# EAGLE board Full (EAGLE 9.6.2)
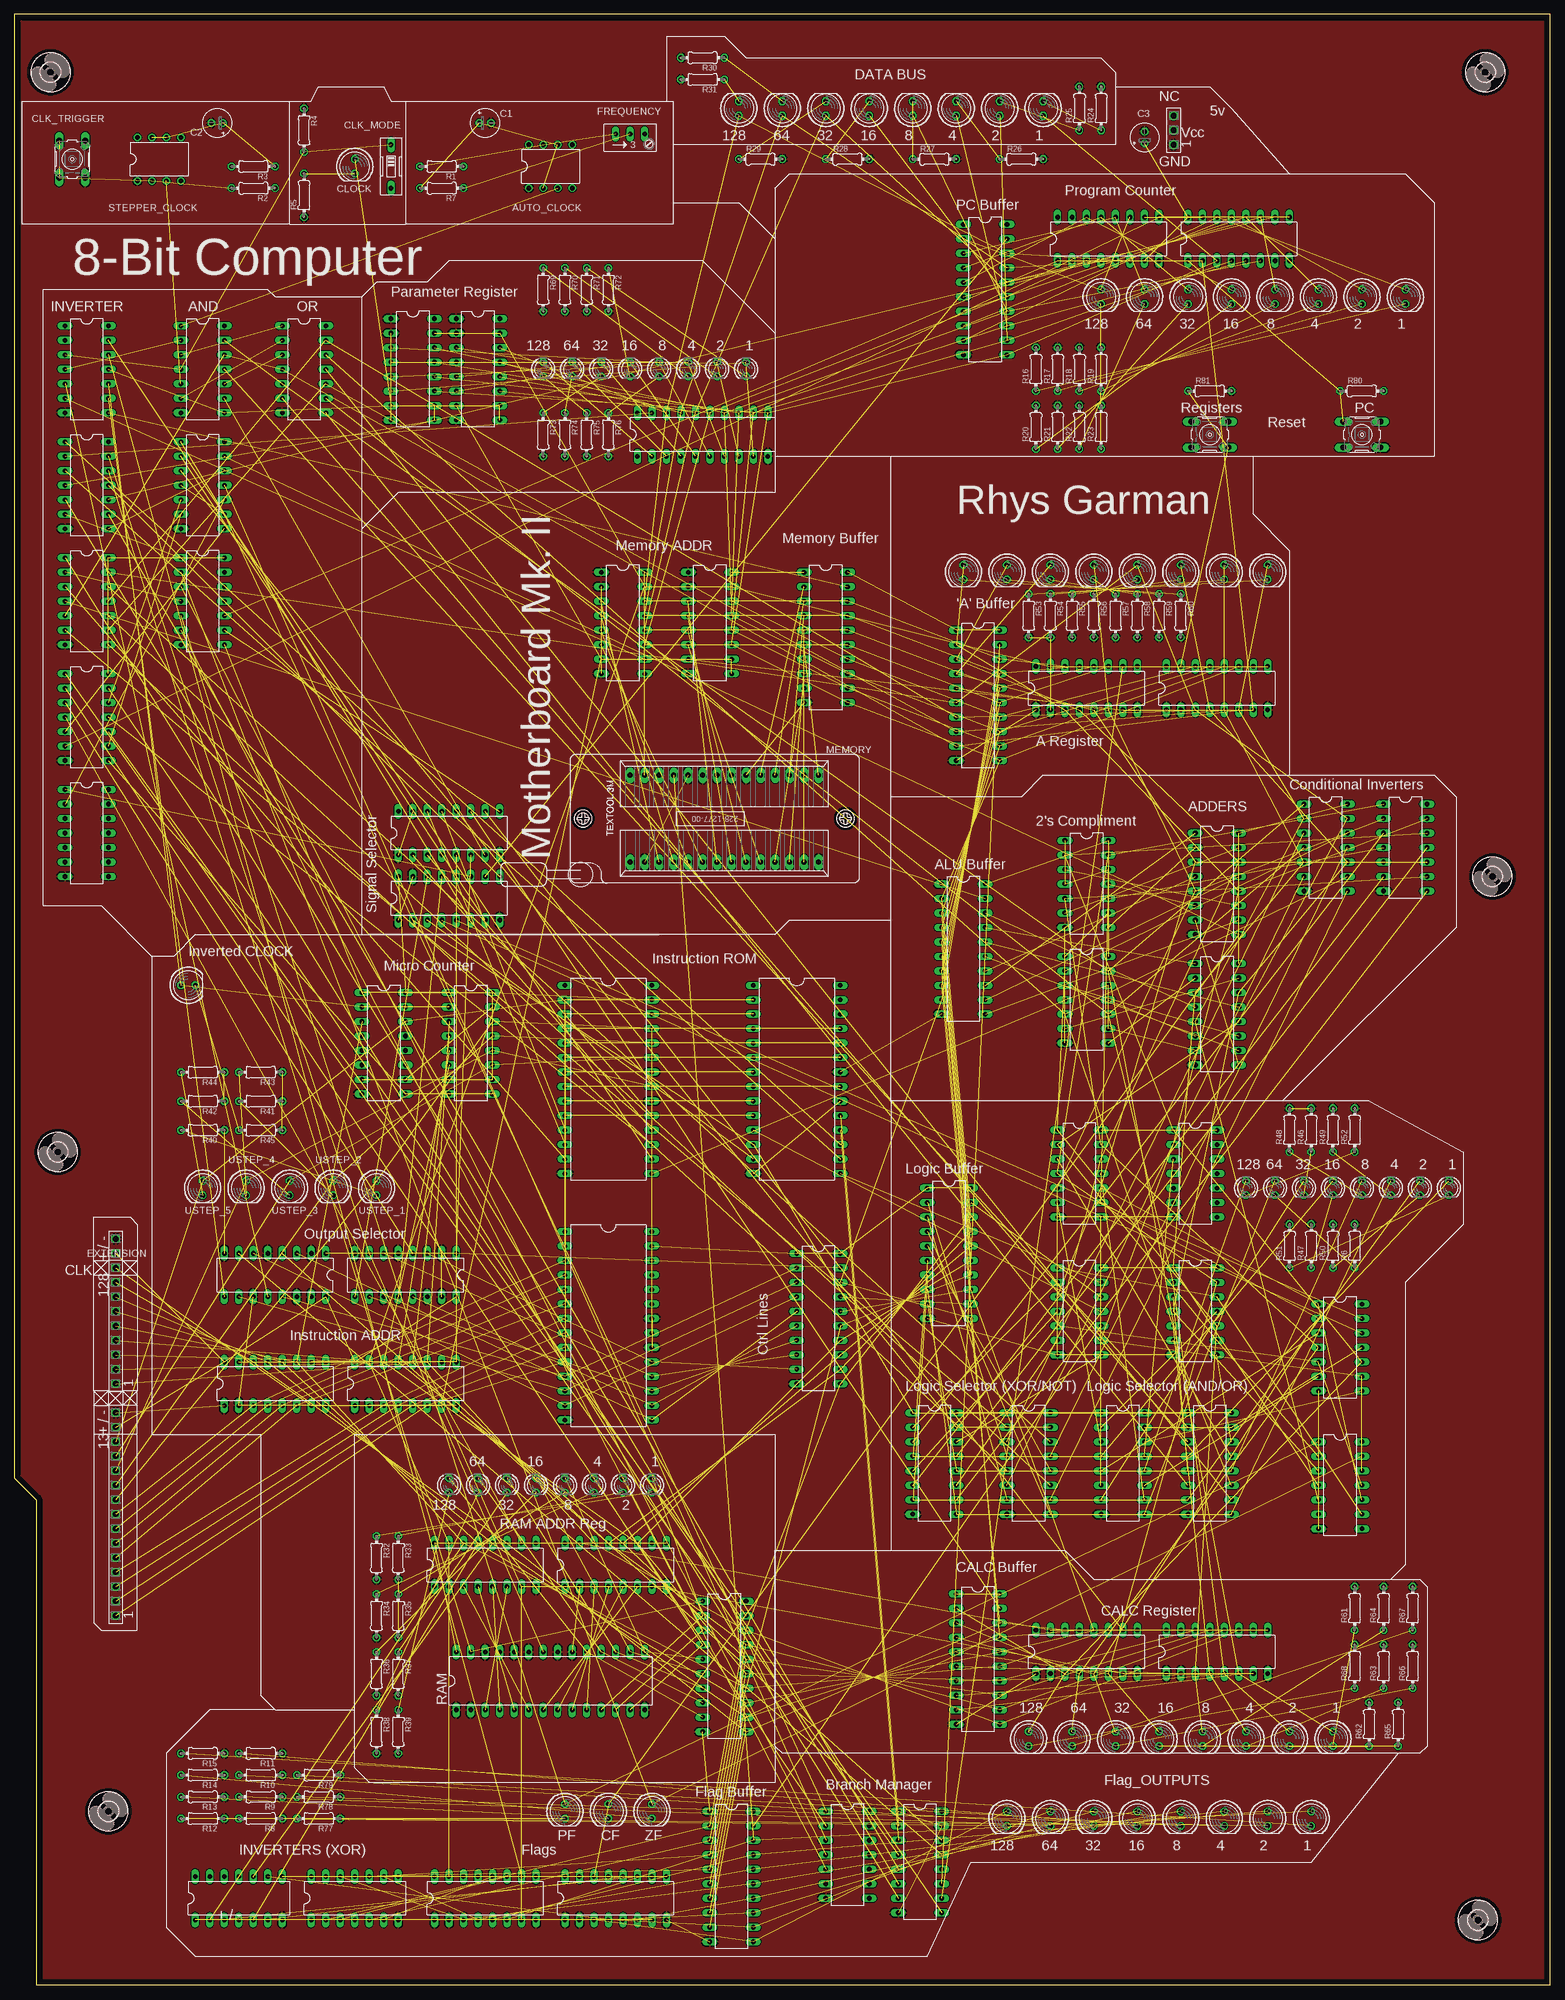
[diagram p5: board, top side]
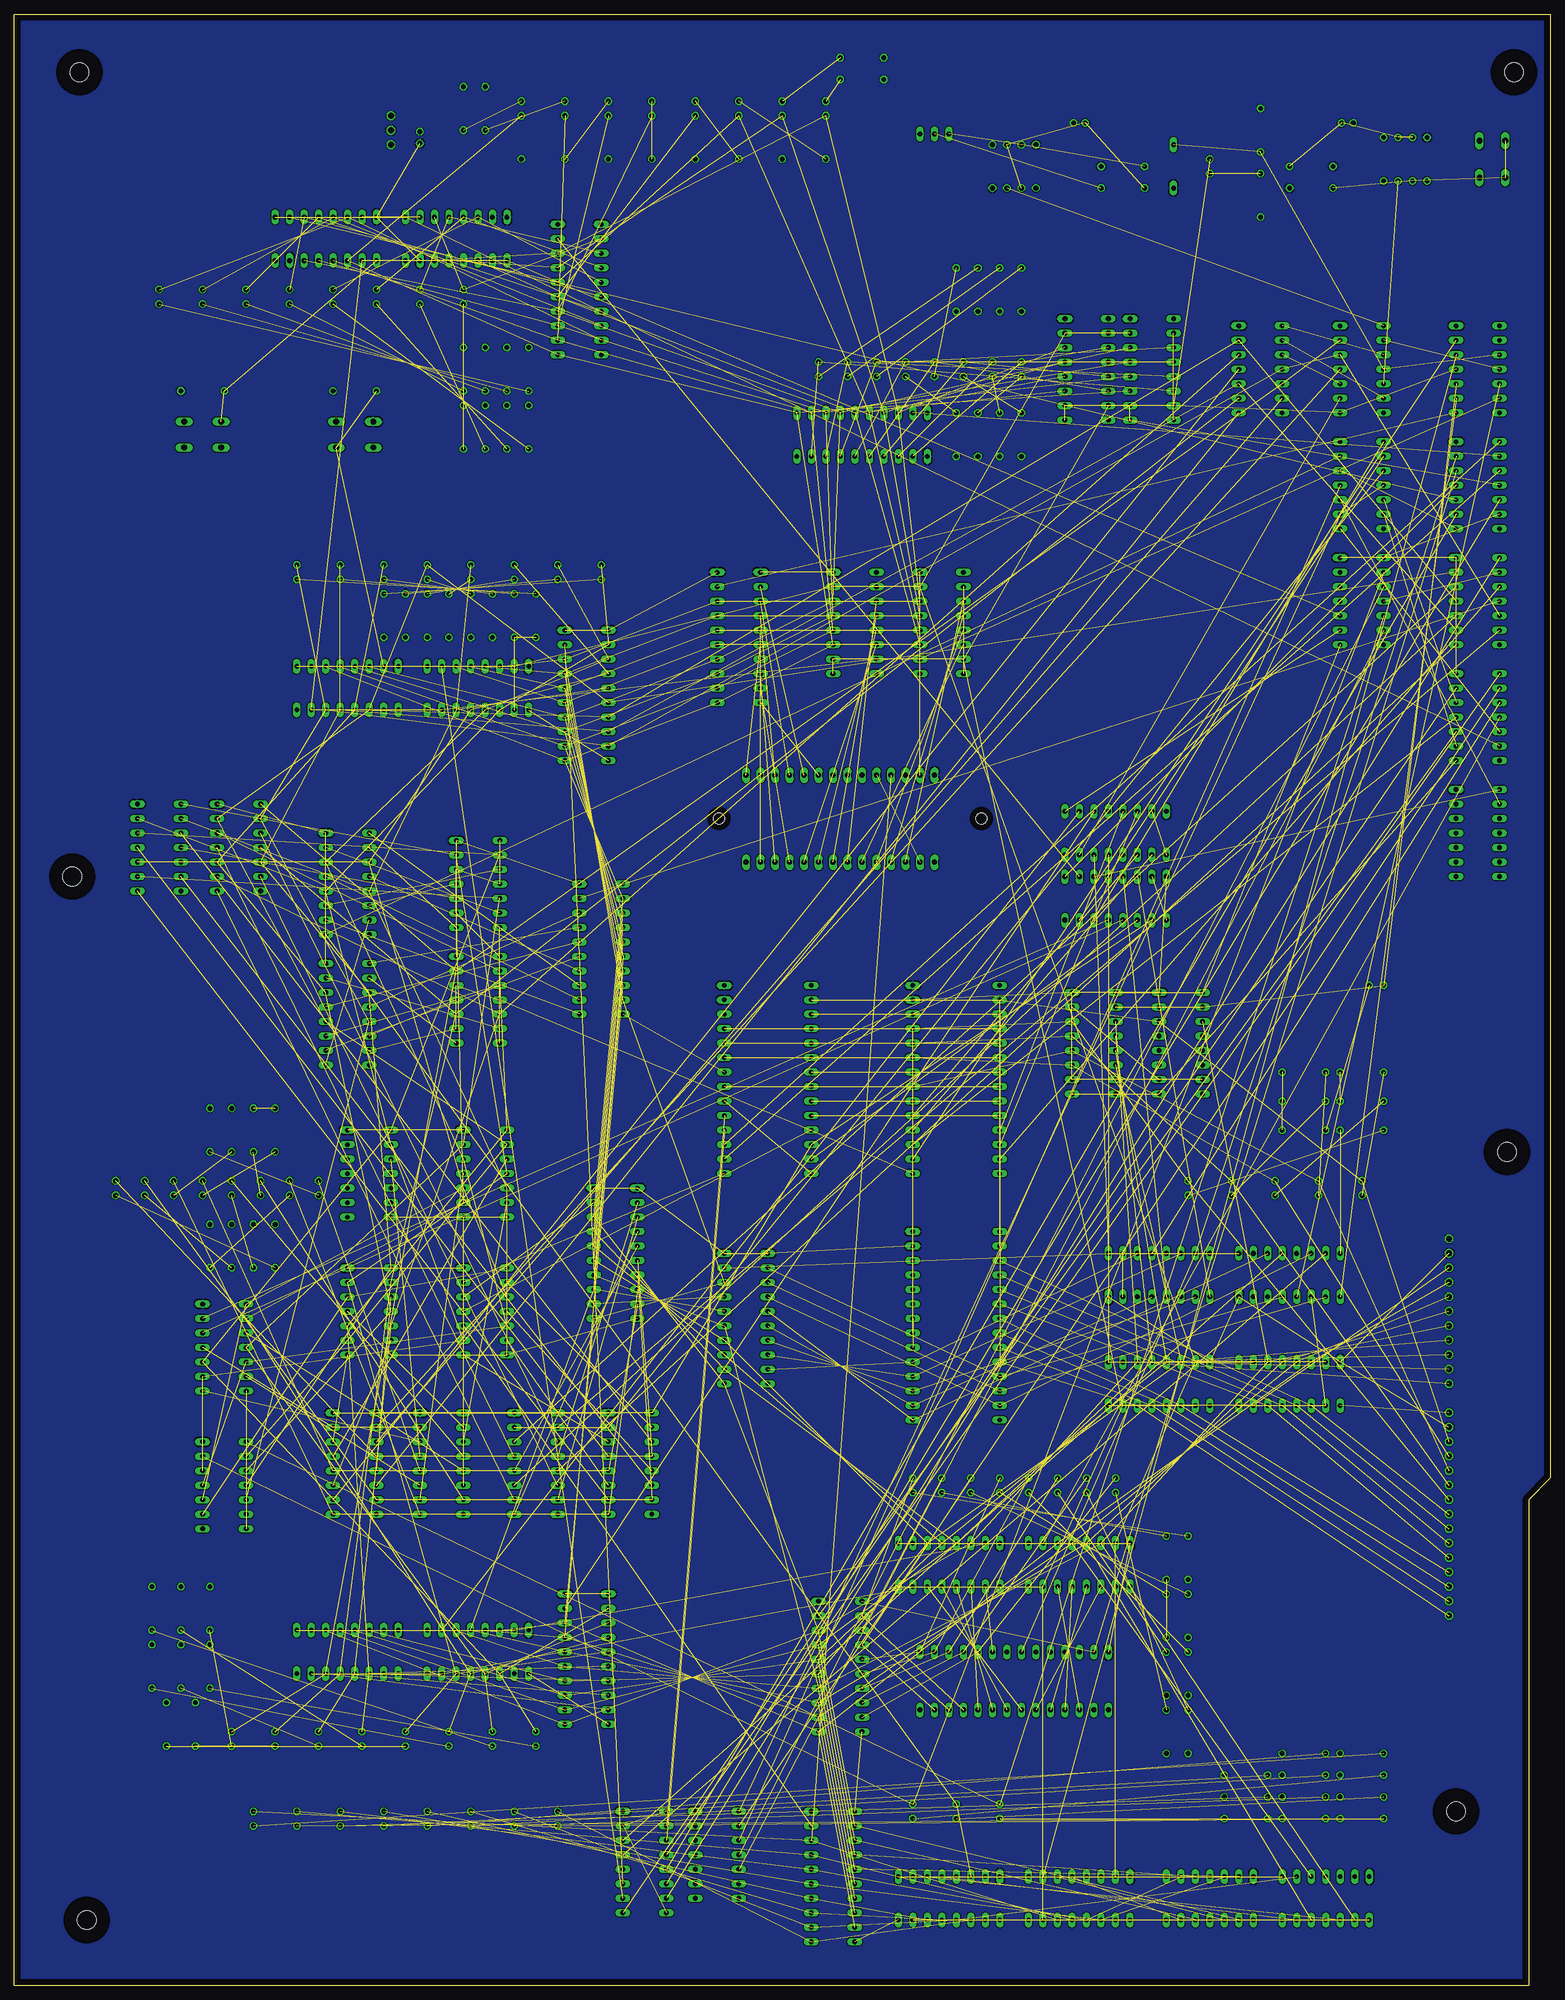
[diagram p6: board, bottom side, seen from below]

Size 269.24 x 345.44 mm. Coordinates in mm from the lower left corner, seen from the top.
Outline: 269.24,345.44 0,345.44 0,88.9 3.81,85.09 3.81,0 269.24,0 269.24,345.44
Copper layers (1*16): Top 0.035mm / dielectric 1.5mm / Bottom 0.035mm
Design rules "default": minimum track width 6mil, minimum drill 0.35mm, track to track 6mil, track to pad 6mil, pad to pad 6mil, via to via 6mil, smd to smd 6mil, copper to edge 40mil, drill to drill 6mil, minimum pad ring 10mil, minimum via ring 8mil, stop-mask expansion 4mil, vias tented up to drill 0mil, thermal gap 10mil

## Footprints (pad centres in the part's own frame; a part is rotated, then mirrored left to right if it is on the bottom)
DIL14 = drill 0.813 long: 1 -7.62,-3.81; 2 -5.08,-3.81; 3 -2.54,-3.81; 4 0,-3.81; 5 2.54,-3.81; 6 5.08,-3.81; 7 7.62,-3.81; 8 7.62,3.81; 9 5.08,3.81; 10 2.54,3.81; 11 0,3.81; 12 -2.54,3.81; 13 -5.08,3.81; 14 -7.62,3.81
DIL16 = drill 0.813 long: 1 -8.89,-3.81; 2 -6.35,-3.81; 3 -3.81,-3.81; 4 -1.27,-3.81; 5 1.27,-3.81; 6 3.81,-3.81; 7 6.35,-3.81; 8 8.89,-3.81; 9 8.89,3.81; 10 6.35,3.81; 11 3.81,3.81; 12 1.27,3.81; 13 -1.27,3.81; 14 -3.81,3.81; 15 -6.35,3.81; 16 -8.89,3.81
DIL08 = drill 0.813 pad 1.27: 1 -3.81,-3.81; 2 -1.27,-3.81; 3 1.27,-3.81; 4 3.81,-3.81; 5 3.81,3.81; 6 1.27,3.81; 7 -1.27,3.81; 8 -3.81,3.81
E2-5 = drill 0.813 pad 1.27: + -1.016,0 | drill 0.813 pad 1.27 octagon: - 1.016,0
EDG-01 = drill 0.813 long: 1 0,-3.81; 2 0,3.81
B3F-10XX = drill 1.016 long: 1 -3.251,2.261; 2 3.251,2.261; 3 -3.251,-2.261; 4 3.251,-2.261
LED5MM = drill 0.813 octagon: A -1.27,0; K 1.27,0
SSW-111-02-G-S = drill 1 pad 1.5 octagon: 1 -12.7,0; 2 -10.16,0; 3 -7.62,0; 4 -5.08,0; 5 -2.54,0; 6 0,0; 7 2.54,0; 8 5.08,0; 9 7.62,0; 10 10.16,0; 11 12.7,0
RJ9W = drill 0.813 long: A 2.54,0.635; E -2.54,0.635; S 0,0.635
DIL28-6 = drill 0.813 long: 1 -16.51,-7.62; 2 -13.97,-7.62; 3 -11.43,-7.62; 4 -8.89,-7.62; 5 -6.35,-7.62; 6 -3.81,-7.62; 7 -1.27,-7.62; 8 1.27,-7.62; 9 3.81,-7.62; 10 6.35,-7.62; 11 8.89,-7.62; 12 11.43,-7.62; 13 13.97,-7.62; 14 16.51,-7.62; 15 16.51,7.62; 16 13.97,7.62; 17 11.43,7.62; 18 8.89,7.62; 19 6.35,7.62; 20 3.81,7.62; 21 1.27,7.62; 22 -1.27,7.62; 23 -3.81,7.62; 24 -6.35,7.62; 25 -8.89,7.62; 26 -11.43,7.62; 27 -13.97,7.62; 28 -16.51,7.62
SSW-115-02-G-S = drill 1 pad 1.5 octagon: 1 -17.78,0; 2 -15.24,0; 3 -12.7,0; 4 -10.16,0; 5 -7.62,0; 6 -5.08,0; 7 -2.54,0; 8 0,0; 9 2.54,0; 10 5.08,0; 11 7.62,0; 12 10.16,0; 13 12.7,0; 14 15.24,0; 15 17.78,0
LED3MM = drill 0.813 octagon: A -1.27,0; K 1.27,0
228-1277-00-0602J = drill 0.9 long: 1 -16.51,-7.62; 2 -13.97,-7.62; 3 -11.43,-7.62; 4 -8.89,-7.62; 5 -6.35,-7.62; 6 -3.81,-7.62; 7 -1.27,-7.62; 8 1.27,-7.62; 9 3.81,-7.62; 10 6.35,-7.62; 11 8.89,-7.62; 12 11.43,-7.62; 13 13.97,-7.62; 14 16.51,-7.62; 15 16.51,7.62; 16 13.97,7.62; 17 11.43,7.62; 18 8.89,7.62; 19 6.35,7.62; 20 3.81,7.62; 21 1.27,7.62; 22 -1.27,7.62; 23 -3.81,7.62; 24 -6.35,7.62; 25 -8.89,7.62; 26 -11.43,7.62; 27 -13.97,7.62; 28 -16.51,7.62 | hole 2: 21.24,0; -24.74,0
DIL20 = drill 0.813 long: 1 -11.43,-3.81; 2 -8.89,-3.81; 3 -6.35,-3.81; 4 -3.81,-3.81; 5 -1.27,-3.81; 6 1.27,-3.81; 7 3.81,-3.81; 8 6.35,-3.81; 9 8.89,-3.81; 10 11.43,-3.81; 11 11.43,3.81; 12 8.89,3.81; 13 6.35,3.81; 14 3.81,3.81; 15 1.27,3.81; 16 -1.27,3.81; 17 -3.81,3.81; 18 -6.35,3.81; 19 -8.89,3.81; 20 -11.43,3.81
0204/7 = drill 0.813 octagon: 1 -3.81,0; 2 3.81,0
DIL28-4 = drill 0.813 long: 1 -16.51,-5.08; 2 -13.97,-5.08; 3 -11.43,-5.08; 4 -8.89,-5.08; 5 -6.35,-5.08; 6 -3.81,-5.08; 7 -1.27,-5.08; 8 1.27,-5.08; 9 3.81,-5.08; 10 6.35,-5.08; 11 8.89,-5.08; 12 11.43,-5.08; 13 13.97,-5.08; 14 16.51,-5.08; 15 16.51,5.08; 16 13.97,5.08; 17 11.43,5.08; 18 8.89,5.08; 19 6.35,5.08; 20 3.81,5.08; 21 1.27,5.08; 22 -1.27,5.08; 23 -3.81,5.08; 24 -6.35,5.08; 25 -8.89,5.08; 26 -11.43,5.08; 27 -13.97,5.08; 28 -16.51,5.08
3,3 = hole 3.3: 0,0
SSW-103-02-G-S = drill 1 pad 1.5 octagon: 1 -2.54,0; 2 0,0; 3 2.54,0

## Placement (x,y rotation side)
4_INP_OR_GATE  4072N  [DIL14]  146.05,22.86 270 top
ADDER_LOWER  74LS283N  [DIL16]  210.82,170.18 270 top
ADDER_UPPER  74LS283N  [DIL16]  210.82,193.04 270 top
ADDR_MEM_REG_LOWER  74LS173N  [DIL16]  121.92,238.76 270 top
ADDR_MEM_REG_UPPER  74LS173N  [DIL16]  106.68,238.76 270 top
ADDR_REG_A_LOWER  74LS173N  [DIL16]  210.82,227.33 0 top
ADDR_REG_A_UPPER  74LS173N  [DIL16]  187.96,227.33 0 top
ADDR_REG_CALC_LOWER  74LS173N  [DIL16]  210.82,58.42 0 top
ADDR_REG_CALC_UPPER  74LS173N  [DIL16]  187.96,58.42 0 top
ADDR_REG_PARAM_LOWER  74LS173N  [DIL16]  69.85,283.21 270 top
ADDR_REG_PARAM_UPPER  74LS173N  [DIL16]  81.28,283.21 270 top
AND_GATE1_  74LS08N  [DIL14]  207.01,118.11 270 top
AND_GATE2_  74LS08N  [DIL14]  232.41,111.76 270 top
AND_GATE3_  74LS08N  [DIL14]  33.02,262.89 270 top
AND_GATE4_  74LS08N  [DIL14]  33.02,242.57 270 top
AND_GATE_  74LS08N  [DIL14]  33.02,283.21 270 top
AUTO_CLOCK  NE555N  [DIL08]  93.98,318.77 0 top
BRANCH_SELECTOR  74HC139N  [DIL16]  158.75,21.59 270 top
C1  4.7uF  [E2-5]  82.55,326.39 0 top
C2  0.1uF  [E2-5]  35.56,326.39 180 top
C3  0.1uF  [E2-5]  198.12,323.85 90 top
CLK_MODE  [EDG-01]  66.04,318.77 180 top
CLK_TRIGGER  [B3F-10XX]  10.16,320.04 90 top
CLOCK  [LED5MM]  59.69,318.77 270 top
DATABUS_1  LED  [LED5MM]  180.34,328.93 90 top
DATABUS_2  [LED5MM]  172.72,328.93 90 top
DATABUS_3  [LED5MM]  165.1,328.93 90 top
DATABUS_4  [LED5MM]  157.48,328.93 90 top
DATABUS_5  [LED5MM]  149.86,328.93 90 top
DATABUS_6  [LED5MM]  142.24,328.93 90 top
DATABUS_7  [LED5MM]  134.62,328.93 90 top
DATABUS_8  [LED5MM]  127,328.93 90 top
EXTENSION  SSW-111-02-G-S  [SSW-111-02-G-S]  17.78,118.11 90 top
FLAG_1  [LED5MM]  227.33,29.21 270 top
FLAG_2  [LED5MM]  219.71,29.21 270 top
FLAG_3  [LED5MM]  212.09,29.21 270 top
FLAG_4  [LED5MM]  204.47,29.21 270 top
FLAG_5  [LED5MM]  196.85,29.21 270 top
FLAG_6  [LED5MM]  189.23,29.21 270 top
FLAG_7  [LED5MM]  181.61,29.21 270 top
FLAG_8  [LED5MM]  173.99,29.21 270 top
FLAG_REG_LOWER  74LS173N  [DIL16]  105.41,15.24 0 top
FLAG_REG_UPPER  74LS173N  [DIL16]  82.55,15.24 0 top
FREQUENCY  100k  [RJ9W]  107.95,323.85 0 top
INSRUCTION_REGISTER_SELECTOR_LOWER  74LS157N  [DIL16]  45.72,124.46 180 top
INSRUCTION_REGISTER_SELECTOR_UPPER  74LS157N  [DIL16]  68.58,124.46 180 top
INSTRUC_REGISTER_LOWER  74LS173N  [DIL16]  68.58,105.41 0 top
INSTRUC_REGISTER_UPPER  74LS173N  [DIL16]  45.72,105.41 0 top
INSTRUCTION_MEMORY_LOWER  AT28C64B  [DIL28-6]  104.14,115.57 270 top
INSTRUCTION_MEMORY_UPPER  AT28C64B  [DIL28-6]  104.14,158.75 270 top
INSTRUCTION_MEMORY_UPPER2  AT28C64B  [DIL28-6]  137.16,158.75 270 top
INSTRUCTIONS_EXTENSION  SSW-115-02-G-S  [SSW-115-02-G-S]  17.78,82.55 90 top
INVERTED_CLK_LED  White  [LED5MM]  30.48,175.26 0 top
LED_A_REG_1  [LED5MM]  219.71,247.65 270 top
LED_A_REG_2  [LED5MM]  212.09,247.65 270 top
LED_A_REG_3  [LED5MM]  204.47,247.65 270 top
LED_A_REG_4  [LED5MM]  196.85,247.65 270 top
LED_A_REG_5  [LED5MM]  189.23,247.65 270 top
LED_A_REG_6  [LED5MM]  181.61,247.65 270 top
LED_A_REG_7  [LED5MM]  173.99,247.65 270 top
LED_A_REG_8  [LED5MM]  166.37,247.65 270 top
LED_B_REG_1  [LED5MM]  231.14,43.18 270 top
LED_B_REG_2  [LED5MM]  223.52,43.18 270 top
LED_B_REG_3  [LED5MM]  215.9,43.18 270 top
LED_B_REG_4  [LED5MM]  208.28,43.18 270 top
LED_B_REG_5  [LED5MM]  200.66,43.18 270 top
LED_B_REG_6  [LED5MM]  193.04,43.18 270 top
LED_B_REG_7  [LED5MM]  185.42,43.18 270 top
LED_B_REG_8  [LED5MM]  177.8,43.18 270 top
LOGIC_LED_1  [LED3MM]  251.46,139.7 270 top
LOGIC_LED_2  [LED3MM]  246.38,139.7 270 top
LOGIC_LED_3  [LED3MM]  241.3,139.7 270 top
LOGIC_LED_4  [LED3MM]  236.22,139.7 270 top
LOGIC_LED_5  [LED3MM]  231.14,139.7 270 top
LOGIC_LED_6  [LED3MM]  226.06,139.7 270 top
LOGIC_LED_7  [LED3MM]  220.98,139.7 270 top
LOGIC_LED_8  [LED3MM]  215.9,139.7 270 top
LOGIC_SELECTOR-AND/OR_LOWER  74LS157N  [DIL16]  209.55,91.44 270 top
LOGIC_SELECTOR-AND/OR_UPPER  74LS157N  [DIL16]  194.31,91.44 270 top
LOGIC_SELECTOR-XOR/NOT_LOWER  74LS157N  [DIL16]  177.8,91.44 270 top
LOGIC_SELECTOR-XOR/NOT_UPPER  74LS157N  [DIL16]  161.29,91.44 270 top
MEMORY  228-1277-00-0602J  [228-1277-00-0602J]  124.46,204.47 0 top
MICRO_COUNTER_LOWER  74LS161  [DIL16]  80.01,165.1 270 top
MICRO_COUNTER_UPPER  74LS161  [DIL16]  64.77,165.1 270 top
NOT_GATE1  74LS04N  [DIL14]  12.7,283.21 270 top
NOT_GATE2_  74LS04N  [DIL14]  12.7,262.89 270 top
NOT_GATE3_  74LS04N  [DIL14]  12.7,242.57 270 top
NOT_GATE4_  74LS04N  [DIL14]  12.7,222.25 270 top
NOT_GATE5_  74LS04N  [DIL14]  12.7,201.93 270 top
NOT_GATE_  74LS04N  [DIL14]  186.69,118.11 270 top
OR_GATE  74LS32N  [DIL14]  186.69,142.24 270 top
OR_GATE1  74LS32N  [DIL14]  50.8,283.21 270 top
OR_GATE_2  74LS32N  [DIL14]  207.01,142.24 270 top
OUTPUT_BUFFER_ALU  74LS245N  [DIL20]  166.37,181.61 270 top
OUTPUT_BUFFER_CALC_REG  74LS245N  [DIL20]  168.91,57.15 270 top
OUTPUT_BUFFER_FLAGS  74HC245N  [DIL20]  125.73,19.05 270 top
OUTPUT_BUFFER_INSTRUCTION  74LS245N  [DIL20]  140.97,116.84 270 top
OUTPUT_BUFFER_LOGIC  74LS245N  [DIL20]  163.83,128.27 270 top
OUTPUT_BUFFER_MEMORY  74LS245N  [DIL20]  142.24,236.22 270 top
OUTPUT_BUFFER_PARAM_REG  74LS245N  [DIL20]  120.65,271.78 0 top
OUTPUT_BUFFER_PC  74LS245N  [DIL20]  170.18,297.18 270 top
OUTPUT_BUFFER_RAM  74HC245N  [DIL20]  124.46,55.88 270 top
OUTPUT_BUFFER_REG_A  74LS245N  [DIL20]  168.91,226.06 270 top
OVERFLOW_FLAG  [LED5MM]  104.14,30.48 270 top
PARAM_LED_1  [LED3MM]  128.27,283.21 270 top
PARAM_LED_2  [LED3MM]  123.19,283.21 270 top
PARAM_LED_3  [LED3MM]  118.11,283.21 270 top
PARAM_LED_4  [LED3MM]  113.03,283.21 270 top
PARAM_LED_5  [LED3MM]  107.95,283.21 270 top
PARAM_LED_6  [LED3MM]  102.87,283.21 270 top
PARAM_LED_7  [LED3MM]  97.79,283.21 270 top
PARAM_LED_8  [LED3MM]  92.71,283.21 270 top
PC_1  [LED5MM]  243.84,295.91 270 top
PC_2  [LED5MM]  236.22,295.91 270 top
PC_3  [LED5MM]  228.6,295.91 270 top
PC_4  [LED5MM]  220.98,295.91 270 top
PC_5  [LED5MM]  213.36,295.91 270 top
PC_6  [LED5MM]  205.74,295.91 270 top
PC_7  [LED5MM]  198.12,295.91 270 top
PC_8  [LED5MM]  190.5,295.91 270 top
POSITIVE_FLAG  [LED5MM]  96.52,30.48 270 top
PROGRAM_COUNTER_LOWER  74LS161  [DIL16]  214.63,306.07 0 top
PROGRAM_COUNTER_UPPER  74LS161  [DIL16]  191.77,306.07 0 top
R1  1k  [0204/7]  74.93,318.77 180 top
R2  1k  [0204/7]  41.91,314.96 180 top
R3  10k  [0204/7]  41.91,318.77 180 top
R4  220  [0204/7]  50.8,325.12 270 top
R5  ~220  [0204/7]  50.8,313.69 90 top
R6  ~220  [0204/7]  234.95,129.54 90 top
R7  220  [0204/7]  74.93,314.96 180 top
R8  ~220  [0204/7]  43.18,29.21 180 top
R9  ~220  [0204/7]  43.18,33.02 180 top
R10  ~220  [0204/7]  43.18,36.83 180 top
R11  ~220  [0204/7]  43.18,40.64 180 top
R12  ~220  [0204/7]  33.02,29.21 180 top
R13  ~220  [0204/7]  33.02,33.02 180 top
R14  ~220  [0204/7]  33.02,36.83 180 top
R15  ~220  [0204/7]  33.02,40.64 180 top
R16  ~220  [0204/7]  179.07,283.21 90 top
R17  ~220  [0204/7]  182.88,283.21 90 top
R18  ~220  [0204/7]  186.69,283.21 90 top
R19  ~220  [0204/7]  190.5,283.21 90 top
R20  ~220  [0204/7]  179.07,273.05 90 top
R21  ~220  [0204/7]  182.88,273.05 90 top
R22  ~220  [0204/7]  186.69,273.05 90 top
R23  ~220  [0204/7]  190.5,273.05 90 top
R24  ~220  [0204/7]  190.5,328.93 90 top
R25  ~220  [0204/7]  186.69,328.93 90 top
R26  ~220  [0204/7]  176.53,320.04 0 top
R27  ~220  [0204/7]  161.29,320.04 0 top
R28  ~220  [0204/7]  146.05,320.04 0 top
R29  ~220  [0204/7]  130.81,320.04 0 top
R30  ~220  [0204/7]  120.65,337.82 180 top
R31  ~220  [0204/7]  120.65,334.01 180 top
R32  ~220  [0204/7]  63.5,74.93 270 top
R33  ~220  [0204/7]  67.31,74.93 270 top
R34  ~220  [0204/7]  63.5,64.77 270 top
R35  ~220  [0204/7]  67.31,64.77 270 top
R36  ~220  [0204/7]  63.5,54.61 270 top
R37  ~220  [0204/7]  67.31,54.61 270 top
R38  ~220  [0204/7]  63.5,44.45 270 top
R39  ~220  [0204/7]  67.31,44.45 270 top
R40  ~220  [0204/7]  33.02,149.86 180 top
R41  ~220  [0204/7]  43.18,154.94 180 top
R42  ~220  [0204/7]  33.02,154.94 180 top
R43  ~220  [0204/7]  43.18,160.02 180 top
R44  ~220  [0204/7]  33.02,160.02 180 top
R45  ~220  [0204/7]  43.18,149.86 180 top
R46  ~220  [0204/7]  227.33,149.86 90 top
R47  ~220  [0204/7]  227.33,129.54 90 top
R48  ~220  [0204/7]  223.52,149.86 90 top
R49  ~220  [0204/7]  231.14,149.86 90 top
R50  ~220  [0204/7]  231.14,129.54 90 top
R51  ~220  [0204/7]  223.52,129.54 90 top
R52  ~220  [0204/7]  234.95,149.86 90 top
R53  ~220  [0204/7]  177.8,240.03 270 top
R54  ~220  [0204/7]  181.61,240.03 270 top
R55  ~220  [0204/7]  185.42,240.03 270 top
R56  ~220  [0204/7]  189.23,240.03 270 top
R57  ~220  [0204/7]  193.04,240.03 270 top
R58  ~220  [0204/7]  196.85,240.03 270 top
R59  ~220  [0204/7]  200.66,240.03 270 top
R60  ~220  [0204/7]  204.47,240.03 270 top
R61  ~220  [0204/7]  234.95,66.04 90 top
R62  ~220  [0204/7]  237.49,45.72 90 top
R63  ~220  [0204/7]  240.03,55.88 90 top
R64  ~220  [0204/7]  240.03,66.04 90 top
R65  ~220  [0204/7]  242.57,45.72 90 top
R66  ~220  [0204/7]  245.11,55.88 90 top
R67  ~220  [0204/7]  245.11,66.04 90 top
R68  ~220  [0204/7]  234.95,55.88 90 top
R69  ~220  [0204/7]  92.71,297.18 270 top
R70  ~220  [0204/7]  96.52,297.18 270 top
R71  ~220  [0204/7]  100.33,297.18 270 top
R72  ~220  [0204/7]  104.14,297.18 270 top
R73  ~220  [0204/7]  92.71,271.78 270 top
R74  ~220  [0204/7]  96.52,271.78 270 top
R75  ~220  [0204/7]  100.33,271.78 270 top
R76  ~220  [0204/7]  104.14,271.78 270 top
R77  ~220  [0204/7]  53.34,29.21 180 top
R78  ~220  [0204/7]  53.34,33.02 180 top
R79  ~220  [0204/7]  53.34,36.83 180 top
R80  ~220  [0204/7]  236.22,279.4 0 top
R81  ~220  [0204/7]  209.55,279.4 0 top
RAM  71256SA15TPG  [DIL28-4]  93.98,53.34 0 top
RAM_ADDR_LOWER  74LS173N  [DIL16]  105.41,73.66 0 top
RAM_ADDR_UPPER  74LS173N  [DIL16]  82.55,73.66 0 top
RAM_LED_1  [LED3MM]  111.76,87.63 270 top
RAM_LED_2  [LED3MM]  106.68,87.63 270 top
RAM_LED_3  [LED3MM]  101.6,87.63 270 top
RAM_LED_4  [LED3MM]  96.52,87.63 270 top
RAM_LED_5  [LED3MM]  91.44,87.63 270 top
RAM_LED_6  [LED3MM]  86.36,87.63 270 top
RAM_LED_7  [LED3MM]  81.28,87.63 270 top
RAM_LED_8  [LED3MM]  76.2,87.63 270 top
RESET_PC  [B3F-10XX]  236.22,271.78 0 top
RESET_REGS  [B3F-10XX]  209.55,271.78 0 top
SELECTOR_LOGIC2_  74HC139N  [DIL16]  76.2,201.93 0 top
SELECTOR_LOGIC_  74HC139N  [DIL16]  76.2,190.5 0 top
STEPPER_CLOCK  NE555N  [DIL08]  25.4,320.04 0 top
SUBTRACT_INVRTR_LOWER_  74LS86N  [DIL14]  187.96,172.72 270 top
SUBTRACT_INVRTR_LOWER_1  74LS86N  [DIL14]  243.84,199.39 270 top
SUBTRACT_INVRTR_UPPER_  74LS86N  [DIL14]  187.96,193.04 270 top
SUBTRACT_INVRTR_UPPER_1  74LS86N  [DIL14]  229.87,199.39 270 top
U$1  [3,3]  7.62,146.05 0 top
U$2  [3,3]  6.35,335.28 0 top
U$3  [3,3]  257.81,335.28 0 top
U$4  [3,3]  256.54,11.43 0 top
U$5  [3,3]  16.51,30.48 0 top
U$6  [3,3]  259.08,194.31 0 top
USTEP_1  [LED5MM]  63.5,139.7 270 top
USTEP_2  [LED5MM]  55.88,139.7 270 top
USTEP_3  [LED5MM]  48.26,139.7 270 top
USTEP_4  [LED5MM]  40.64,139.7 270 top
USTEP_5  [LED5MM]  33.02,139.7 270 top
X1  SSW-103-02-G-S  [SSW-103-02-G-S]  203.2,325.12 90 top
XOR_GATE_1  74LS86N  [DIL14]  59.69,15.24 0 top
XOR_GATE_2  74LS86N  [DIL14]  39.37,15.24 0 top
ZERO_FLAG  [LED5MM]  111.76,30.48 270 top
ZERO_POS_FLAG_IDENTIFIER  744078N  [DIL14]  232.41,87.63 270 top

## Tracks (layer width: path | path; a pad name or v marks a point on that pad's centre or on a via)
1_PLACE  (20 unrouted)
2_PLACE  (20 unrouted)
4_PLACE  (20 unrouted)
8_PLACE  (20 unrouted)
16_PLACE  (20 unrouted)
32_PLACE  (19 unrouted)
64_PLACE  (19 unrouted)
128_PLACE  (18 unrouted)
>0_FLAG  (2 unrouted)
CALC_IN  (4 unrouted)
CALC_OUT  (1 unrouted)
CLOCK  (19 unrouted)
CLR_REG  (15 unrouted)
COUNTERS_CLEAR  (4 unrouted)
CTRL_SIG_1  (2 unrouted)
CTRL_SIG_2  (2 unrouted)
CTRL_SIG_3  (2 unrouted)
CTRL_SIG_4  (2 unrouted)
CTRL_SIG_5  (2 unrouted)
CTRL_SIG_6  (2 unrouted)
CTRL_SIG_7  (2 unrouted)
CTRL_SIG_8  (2 unrouted)
CTRL_SIG_9  (1 unrouted)
CTRL_SIG_10  (1 unrouted)
CTRL_SIG_11  (1 unrouted)
CTRL_SIG_12  (9 unrouted)
CTRL_SIG_13  (1 unrouted)
CTRL_SIG_14  (1 unrouted)
CTRL_SIG_15  (1 unrouted)
CTRL_SIG_16  (1 unrouted)
CTRL_SIG_17_(FLAG_OUT)  (1 unrouted)
CTRL_SIG_18_(LOGIC_SELECT_1)  (5 unrouted)
CTRL_SIG_19_(LOGIC_SELECT_2)  (1 unrouted)
CTRL_SIG_20_(LOGIC_OUT)  (1 unrouted)
CTRL_SIG_21_(P_REG_IN)  (1 unrouted)
CTRL_SIG_22_(P_REG_OUT)  (1 unrouted)
CTRL_SIG_23_(LOOP_CONTROL_B)  (1 unrouted)
CTRL_SIG_24_(LOOP_CONTROL_A)  (1 unrouted)
END_CRNT_CMD  (1 unrouted)
END_CRNT_CMD&&BTN_PRESS  (2 unrouted)
GND  (37 unrouted)
  pour Top: 0,345.44 0,88.9 3.81,85.09 3.81,0 269.24,0 269.24,345.44
HLT_SIGNAL  (1 unrouted)
INSTRUCTION__A4  (4 unrouted)
INSTRUCTION_A0  (4 unrouted)
INSTRUCTION_A1  (4 unrouted)
INSTRUCTION_A2  (4 unrouted)
INSTRUCTION_A4  (4 unrouted)
INSTRUCTION_A5  (4 unrouted)
INSTRUCTION_A6  (4 unrouted)
INSTRUCTION_A7  (4 unrouted)
INSTRUCTION_IN  (4 unrouted)
INSTRUCTION_OUTPUT  (3 unrouted)
INV_FLAG_TOGGLE_IN  (4 unrouted)
INVERTED_CLOCK  (3 unrouted)
LOGIC_1  (3 unrouted)
LOGIC_2  (3 unrouted)
LOGIC_3  (3 unrouted)
LOGIC_4  (3 unrouted)
LOGIC_5  (3 unrouted)
LOGIC_6  (3 unrouted)
LOGIC_7  (3 unrouted)
LOGIC_8  (3 unrouted)
MEMORY_IN  (1 unrouted)
MEMORY_OUT  (1 unrouted)
MICRO_A8  (5 unrouted)
MICRO_A9  (5 unrouted)
MICRO_A10  (5 unrouted)
MICRO_A11  (5 unrouted)
MICRO_A12  (5 unrouted)
MODE_SIGNAL  (3 unrouted)
N$1  (3 unrouted)
N$2  (3 unrouted)
N$3  (1 unrouted)
N$4  (1 unrouted)
N$5  (1 unrouted)
N$6  (1 unrouted)
N$7  (1 unrouted)
N$8  (1 unrouted)
N$9  (1 unrouted)
N$11  (1 unrouted)
N$12  (1 unrouted)
N$13  (1 unrouted)
N$14  (1 unrouted)
N$15  (1 unrouted)
N$16  (3 unrouted)
N$17  (1 unrouted)
N$18  (3 unrouted)
N$19  (1 unrouted)
N$20  (1 unrouted)
N$21  (1 unrouted)
N$22  (1 unrouted)
N$23  (1 unrouted)
N$24  (1 unrouted)
N$25  (1 unrouted)
N$27  (1 unrouted)
N$28  (2 unrouted)
N$29  (2 unrouted)
N$30  (2 unrouted)
N$31  (2 unrouted)
N$32  (2 unrouted)
N$33  (2 unrouted)
N$34  (2 unrouted)
N$35  (1 unrouted)
N$36  (1 unrouted)
N$37  (2 unrouted)
N$38  (1 unrouted)
N$39  (1 unrouted)
N$41  (2 unrouted)
N$42  (3 unrouted)
N$43  (1 unrouted)
N$44  (3 unrouted)
N$45  (1 unrouted)
N$46  (1 unrouted)
N$47  (1 unrouted)
N$48  (1 unrouted)
N$49  (1 unrouted)
N$50  (1 unrouted)
N$51  (1 unrouted)
N$52  (1 unrouted)
N$53  (1 unrouted)
N$54  (3 unrouted)
N$55  (1 unrouted)
N$57  (4 unrouted)
N$58  (1 unrouted)
N$59  (1 unrouted)
N$60  (1 unrouted)
N$62  (1 unrouted)
N$64  (1 unrouted)
N$65  (1 unrouted)
N$66  (1 unrouted)
N$67  (1 unrouted)
N$68  (1 unrouted)
N$69  (1 unrouted)
N$70  (1 unrouted)
N$71  (3 unrouted)
N$72  (1 unrouted)
N$73  (2 unrouted)
N$76  (1 unrouted)
N$77  (1 unrouted)
N$78  (2 unrouted)
N$79  (1 unrouted)
N$80  (1 unrouted)
N$81  (1 unrouted)
N$82  (1 unrouted)
N$83  (1 unrouted)
N$84  (1 unrouted)
N$85  (1 unrouted)
N$86  (1 unrouted)
N$87  (1 unrouted)
N$88  (1 unrouted)
N$89  (1 unrouted)
N$90  (1 unrouted)
N$91  (1 unrouted)
N$92  (1 unrouted)
N$93  (1 unrouted)
N$94  (1 unrouted)
N$95  (1 unrouted)
N$96  (1 unrouted)
N$97  (1 unrouted)
N$98  (1 unrouted)
N$99  (1 unrouted)
N$100  (1 unrouted)
N$101  (1 unrouted)
N$102  (1 unrouted)
N$103  (1 unrouted)
N$104  (1 unrouted)
N$105  (1 unrouted)
N$106  (1 unrouted)
N$107  (2 unrouted)
N$108  (1 unrouted)
N$109  (1 unrouted)
N$110  (2 unrouted)
N$111  (4 unrouted)
N$112  (1 unrouted)
N$114  (1 unrouted)
N$115  (1 unrouted)
N$116  (1 unrouted)
N$117  (1 unrouted)
N$118  (1 unrouted)
N$119  (1 unrouted)
N$120  (1 unrouted)
N$121  (1 unrouted)
N$122  (1 unrouted)
N$123  (1 unrouted)
N$124  (1 unrouted)
N$125  (1 unrouted)
N$126  (1 unrouted)
N$127  (1 unrouted)
N$128  (1 unrouted)
N$129  (1 unrouted)
N$130  (1 unrouted)
N$131  (1 unrouted)
N$132  (1 unrouted)
N$133  (1 unrouted)
N$134  (1 unrouted)
N$135  (1 unrouted)
N$136  (1 unrouted)
N$137  (1 unrouted)
N$138  (1 unrouted)
N$140  (1 unrouted)
N$141  (1 unrouted)
N$142  (1 unrouted)
N$143  (1 unrouted)
N$144  (1 unrouted)
N$145  (1 unrouted)
N$146  (1 unrouted)
N$147  (1 unrouted)
N$148  (1 unrouted)
N$149  (1 unrouted)
N$150  (1 unrouted)
N$151  (1 unrouted)
N$152  (1 unrouted)
N$153  (1 unrouted)
N$154  (1 unrouted)
N$155  (1 unrouted)
N$156  (1 unrouted)
N$157  (1 unrouted)
N$158  (1 unrouted)
N$159  (1 unrouted)
N$160  (1 unrouted)
N$161  (1 unrouted)
N$162  (1 unrouted)
N$163  (1 unrouted)
N$164  (1 unrouted)
N$165  (1 unrouted)
N$167  (2 unrouted)
N$168  (1 unrouted)
N$169  (1 unrouted)
N$170  (1 unrouted)
N$171  (2 unrouted)
N$172  (2 unrouted)
N$173  (2 unrouted)
N$174  (2 unrouted)
N$175  (2 unrouted)
N$176  (1 unrouted)
N$177  (1 unrouted)
N$178  (1 unrouted)
N$179  (1 unrouted)
N$180  (1 unrouted)
N$181  (1 unrouted)
N$182  (1 unrouted)
N$183  (1 unrouted)
N$184  (1 unrouted)
N$185  (1 unrouted)
N$186  (1 unrouted)
N$187  (1 unrouted)
N$188  (1 unrouted)
N$189  (1 unrouted)
N$190  (1 unrouted)
N$191  (1 unrouted)
N$192  (1 unrouted)
N$193  (1 unrouted)
N$194  (2 unrouted)
N$195  (2 unrouted)
N$196  (2 unrouted)
N$197  (1 unrouted)
N$198  (1 unrouted)
N$199  (1 unrouted)
N$200  (1 unrouted)
N$201  (1 unrouted)
N$202  (1 unrouted)
N$203  (1 unrouted)
N$204  (1 unrouted)
N$205  (1 unrouted)
N$206  (1 unrouted)
N$207  (1 unrouted)
N$209  (1 unrouted)
N$212  (1 unrouted)
N$217  (3 unrouted)
N$219  (1 unrouted)
N$220  (1 unrouted)
N$221  (1 unrouted)
N$222  (1 unrouted)
N$223  (1 unrouted)
N$225  (1 unrouted)
N$226  (1 unrouted)
N$227  (1 unrouted)
N$228  (1 unrouted)
N$229  (1 unrouted)
OF_SELECTED  (1 unrouted)
OVERFLOW_FLAG  (3 unrouted)
PC_INC  (1 unrouted)
PC_LOAD  (1 unrouted)
PC_LOAD_SIGNAL  (1 unrouted)
PC_OUT  (1 unrouted)
PF_SELECTED  (1 unrouted)
RAM_ADDR_IN  (1 unrouted)
RAM_WRITE  (2 unrouted)
REG_A_1PLACE  (8 unrouted)
REG_A_2PLACE  (8 unrouted)
REG_A_4PLACE  (8 unrouted)
REG_A_8PLACE  (8 unrouted)
REG_A_16PLACE  (8 unrouted)
REG_A_32PLACE  (8 unrouted)
REG_A_64PLACE  (8 unrouted)
REG_A_128PLACE  (8 unrouted)
REG_A_IN  (4 unrouted)
REG_A_OUT  (1 unrouted)
REG_B_1PLACE  (6 unrouted)
REG_B_2PLACE  (6 unrouted)
REG_B_4PLACE  (6 unrouted)
REG_B_8PLACE  (6 unrouted)
REG_B_16PLACE  (6 unrouted)
REG_B_32PLACE  (6 unrouted)
REG_B_64PLACE  (6 unrouted)
REG_B_128PLACE  (6 unrouted)
REG_P_1PLACE  (2 unrouted)
REG_P_2PLACE  (2 unrouted)
REG_P_4PLACE  (2 unrouted)
REG_P_8PLACE  (2 unrouted)
REG_P_16PLACE  (2 unrouted)
REG_P_32PLACE  (2 unrouted)
REG_P_64PLACE  (2 unrouted)
REG_P_128PLACE  (2 unrouted)
SUB_COUNTER_LOAD  (1 unrouted)
SUB_LOAD_SIGNAL  (1 unrouted)
SUM_1  (1 unrouted)
SUM_2  (1 unrouted)
SUM_4  (1 unrouted)
SUM_8  (1 unrouted)
SUM_16  (1 unrouted)
SUM_32  (1 unrouted)
SUM_64  (1 unrouted)
SUM_128  (1 unrouted)
SUM_CARRY  (1 unrouted)
UNCONDITIONAL_SELECTED  (1 unrouted)
VCC  (36 unrouted)
  pour Bottom: 0,345.44 0,88.9 3.81,85.09 3.81,0 269.24,0 269.24,345.44
ZERO_FLAG  (2 unrouted)
ZF_SELECTED  (1 unrouted)
~DATA/PARAM  (4 unrouted)
~MEMORY_IN  (4 unrouted)
~MEMORY_OUT  (1 unrouted)
~PC_INC  (1 unrouted)
~PC_LOAD  (2 unrouted)
~SUB_COUNTER_LOAD  (2 unrouted)

## Text on the board
tNames: DATA BUS | NC | 5v | 128 | 64 | 32 | 16 | 8 | 4 | 2 | 1 | Vcc | GND | Program Counter | PC Buffer | 8-Bit Computer | Parameter Register | INVERTER | AND | OR | 128 | 64 | 32 | 16 | 8 | 4 | 2 | 1 | 128 | 64 | 32 | 16 | 8 | 4 | 2 | 1 | Registers | PC | Reset | Motherboard Mk. II | Rhys Garman | Memory Buffer | Memory ADDR | 'A' Buffer | A Register | Conditional Inverters | ADDERS | 2's Compliment | ALU Buffer | Signal Selector | Inverted CLOCK | Instruction ROM | Micro Counter | 128 | 64 | 32 | 16 | 8 | 4 | 2 | 1 | Logic Buffer | Output Selector | + / - | CLK | 128 | Instruction ADDR | Ctrl Lines | Logic Selector (XOR/NOT) | Logic Selector (AND/OR) | + / - | 13 | 64 | 16 | 4 | 1 | 128 | 32 | 8 | 2 | RAM ADDR Reg | CALC Buffer | CALC Register | 128 | 64 | 32 | 16 | 8 | 4 | 2 | 1 | Flag_OUTPUTS | Branch Manager | Flag Buffer | PF | CF | ZF | 128 | 64 | 32 | 16 | 8 | 4 | 2 | 1 | INVERTERS (XOR) | Flags | + / -